# Altium project 06_Dataflow_Modeling.PrjPcb
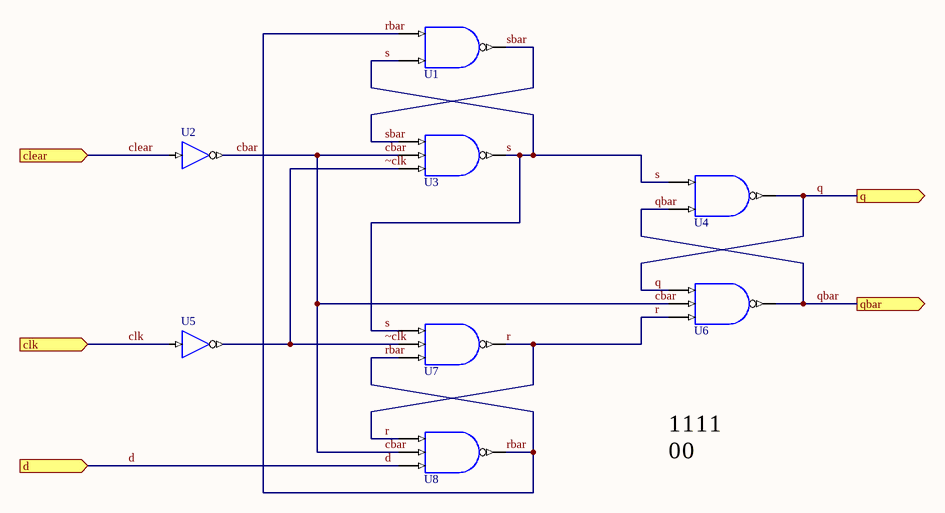
[diagram p0: edge_dff.SchDoc]
6 sheets, 62 parts. Net scope: flat (ports and power ports of the same name join across sheets).
Sheets:
  edge_dff.SchDoc
  edge_dff_drafts.SchDoc
  edge_dff_rst_active.SchDoc
  edge_dff_clk_high.SchDoc
  edge_dff_clk_low.SchDoc
  CarryLookahead.SchDoc

## Sheet edge_dff.SchDoc
size A4

### Parts
U1  AND 2  (value not drawn)
U2  BUF_inv  (value not drawn)
U3  NAND_3  (value not drawn)
U4  AND 2  (value not drawn)
U5  BUF_inv  (value not drawn)
U6  NAND_3  (value not drawn)
U7  NAND_3  (value not drawn)
U8  NAND_3  (value not drawn)

### Ports
clear (in), clk (in), d (in), q (out), qbar (out)

### Nets
cbar: U2.O U3.B U6.B U8.B
clear: U2.I ; port clear
clk: U5.I ; port clk
d: U8.C ; port d
q: U4.Y U6.A ; port q
qbar: U4.B U6.Y ; port qbar
r: U6.C U7.Y U8.A
rbar: U1.A U7.C U8.Y
s: U1.B U3.Y U4.A U7.A
sbar: U1.Y U3.A
~clk: U3.C U5.O U7.B

### Notes on the sheet
- 1
- 0

### Library data of the parts
U1 U4 = AND_2: 2 Input AND
U2 U5 = BUF_inv: 1-bit General Purpose (Non-inverting) Buffer
U3 U6-U8 = NAND_3: 3 Input NAND 1 Not

## Sheet edge_dff_drafts.SchDoc
size A4
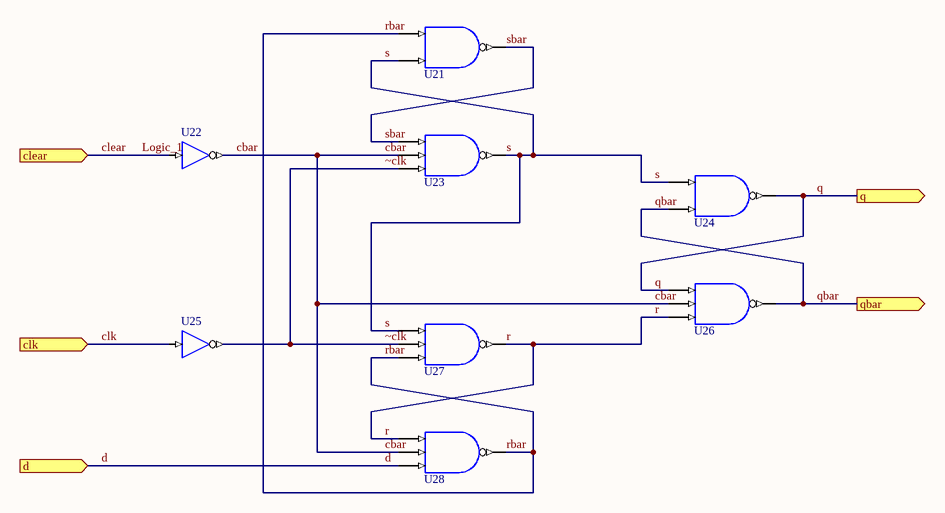
[diagram p1: edge_dff_drafts.SchDoc]

### Parts
U21  AND 2  (value not drawn)
U22  BUF_inv  (value not drawn)
U23  NAND_3  (value not drawn)
U24  AND 2  (value not drawn)
U25  BUF_inv  (value not drawn)
U26  NAND_3  (value not drawn)
U27  NAND_3  (value not drawn)
U28  NAND_3  (value not drawn)

### Ports
clear (in), clk (in), d (in), q (out), qbar (out)

### Nets
cbar: U22.O U23.B U26.B U28.B
clear: U22.I ; port clear  [also labelled Logic_1]
clk: U25.I ; port clk
d: U28.C ; port d
q: U24.Y U26.A ; port q
qbar: U24.B U26.Y ; port qbar
r: U26.C U27.Y U28.A
rbar: U21.A U27.C U28.Y
s: U21.B U23.Y U24.A U27.A
sbar: U21.Y U23.A
~clk: U23.C U25.O U27.B

### Library data of the parts
U21 U24 = AND_2: 2 Input AND
U22 U25 = BUF_inv: as U2 on sheet edge_dff
U23 U26-U28 = NAND_3: 3 Input NAND 1 Not

## Sheet edge_dff_rst_active.SchDoc
size A4
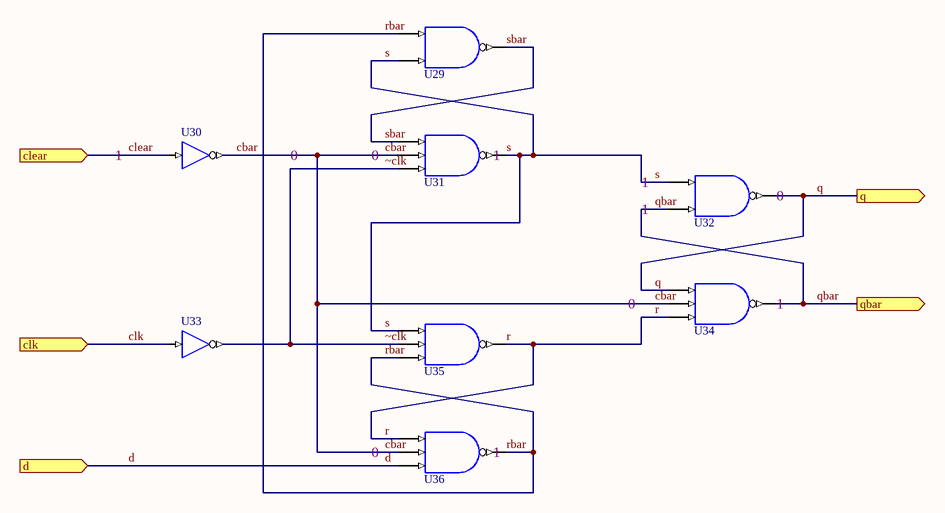
[diagram p2: edge_dff_rst_active.SchDoc]

### Parts
U29  AND 2  (value not drawn)
U30  BUF_inv  (value not drawn)
U31  NAND_3  (value not drawn)
U32  AND 2  (value not drawn)
U33  BUF_inv  (value not drawn)
U34  NAND_3  (value not drawn)
U35  NAND_3  (value not drawn)
U36  NAND_3  (value not drawn)

### Ports
clear (in), clk (in), d (in), q (out), qbar (out)

### Nets
cbar: U30.O U31.B U34.B U36.B
clear: U30.I ; port clear
clk: U33.I ; port clk
d: U36.C ; port d
q: U32.Y U34.A ; port q
qbar: U32.B U34.Y ; port qbar
r: U34.C U35.Y U36.A
rbar: U29.A U35.C U36.Y
s: U29.B U31.Y U32.A U35.A
sbar: U29.Y U31.A
~clk: U31.C U33.O U35.B

### Notes on the sheet
- 1
- 0
- (near U31) 0
- (near U31) 1
- (near U32) 1
- (near U32) 0
- (near U34) 1
- (near U36) 0
- (near U36) 1

### Library data of the parts
U29 U32 = AND_2: 2 Input AND
U30 U33 = BUF_inv: as U2 on sheet edge_dff
U31 U34-U36 = NAND_3: 3 Input NAND 1 Not

## Sheet edge_dff_clk_high.SchDoc
size A4
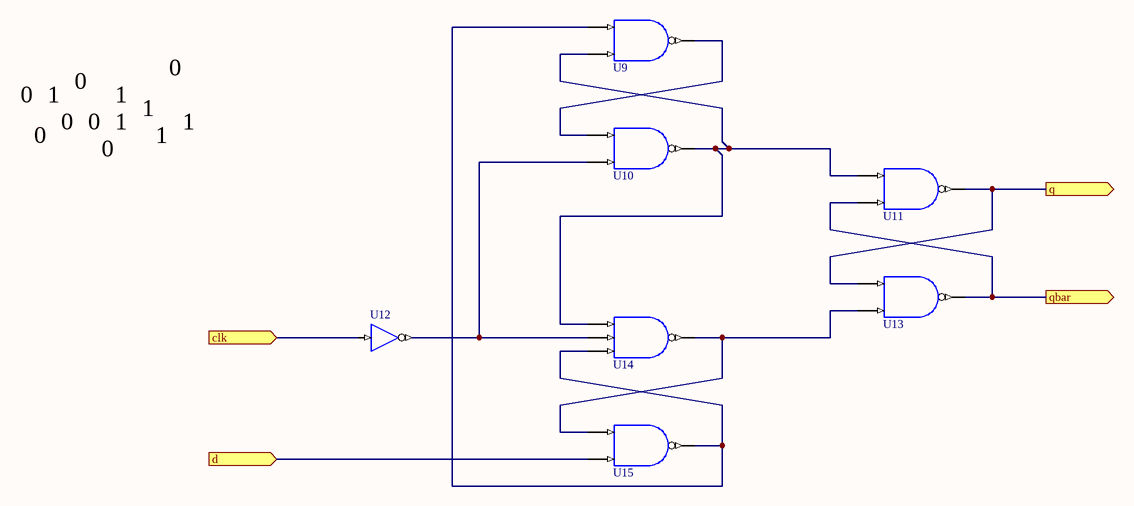
[diagram p3: edge_dff_clk_high.SchDoc]

### Parts
U9  AND 2  (value not drawn)
U10  AND 2  (value not drawn)
U11  AND 2  (value not drawn)
U12  BUF_inv  (value not drawn)
U13  AND 2  (value not drawn)
U14  NAND_3  (value not drawn)
U15  AND 2  (value not drawn)

### Ports
clk (in), d (in), q (out), qbar (out)

### Nets
clk: U12.I ; port clk
d: U15.B ; port d
q: U11.Y U13.A ; port q
qbar: U11.B U13.Y ; port qbar
NetU9_A: U9.A U14.C U15.Y
NetU9_B: U9.B U10.Y U11.A U14.A
NetU9_Y: U9.Y U10.A
NetU10_B: U10.B U12.O U14.B
NetU13_B: U13.B U14.Y U15.A

### Notes on the sheet
- 0
- 1

### Library data of the parts
U9-U11 U13 U15 = AND_2: 2 Input AND
U12 = BUF_inv: as U2 on sheet edge_dff
U14 = NAND_3: 3 Input NAND 1 Not

## Sheet edge_dff_clk_low.SchDoc
size A4
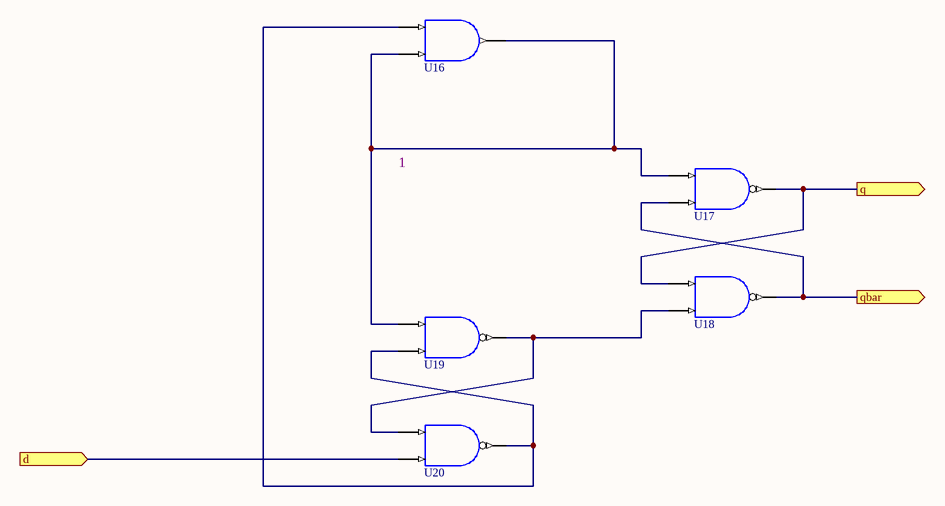
[diagram p4: edge_dff_clk_low.SchDoc]

### Parts
U16  AND 2  (value not drawn)
U17  AND 2  (value not drawn)
U18  AND 2  (value not drawn)
U19  AND 2  (value not drawn)
U20  AND 2  (value not drawn)

### Ports
d (in), q (out), qbar (out)

### Nets
d: U20.B ; port d
q: U17.Y U18.A ; port q
qbar: U17.B U18.Y ; port qbar
NetU16_A: U16.A U19.B U20.Y
NetU16_B: U16.B U16.Y U17.A U19.A
NetU18_B: U18.B U19.Y U20.A

### Notes on the sheet
- 1

### Library data of the parts
U16-U20 = AND_2: 2 Input AND

## Sheet CarryLookahead.SchDoc
size A4
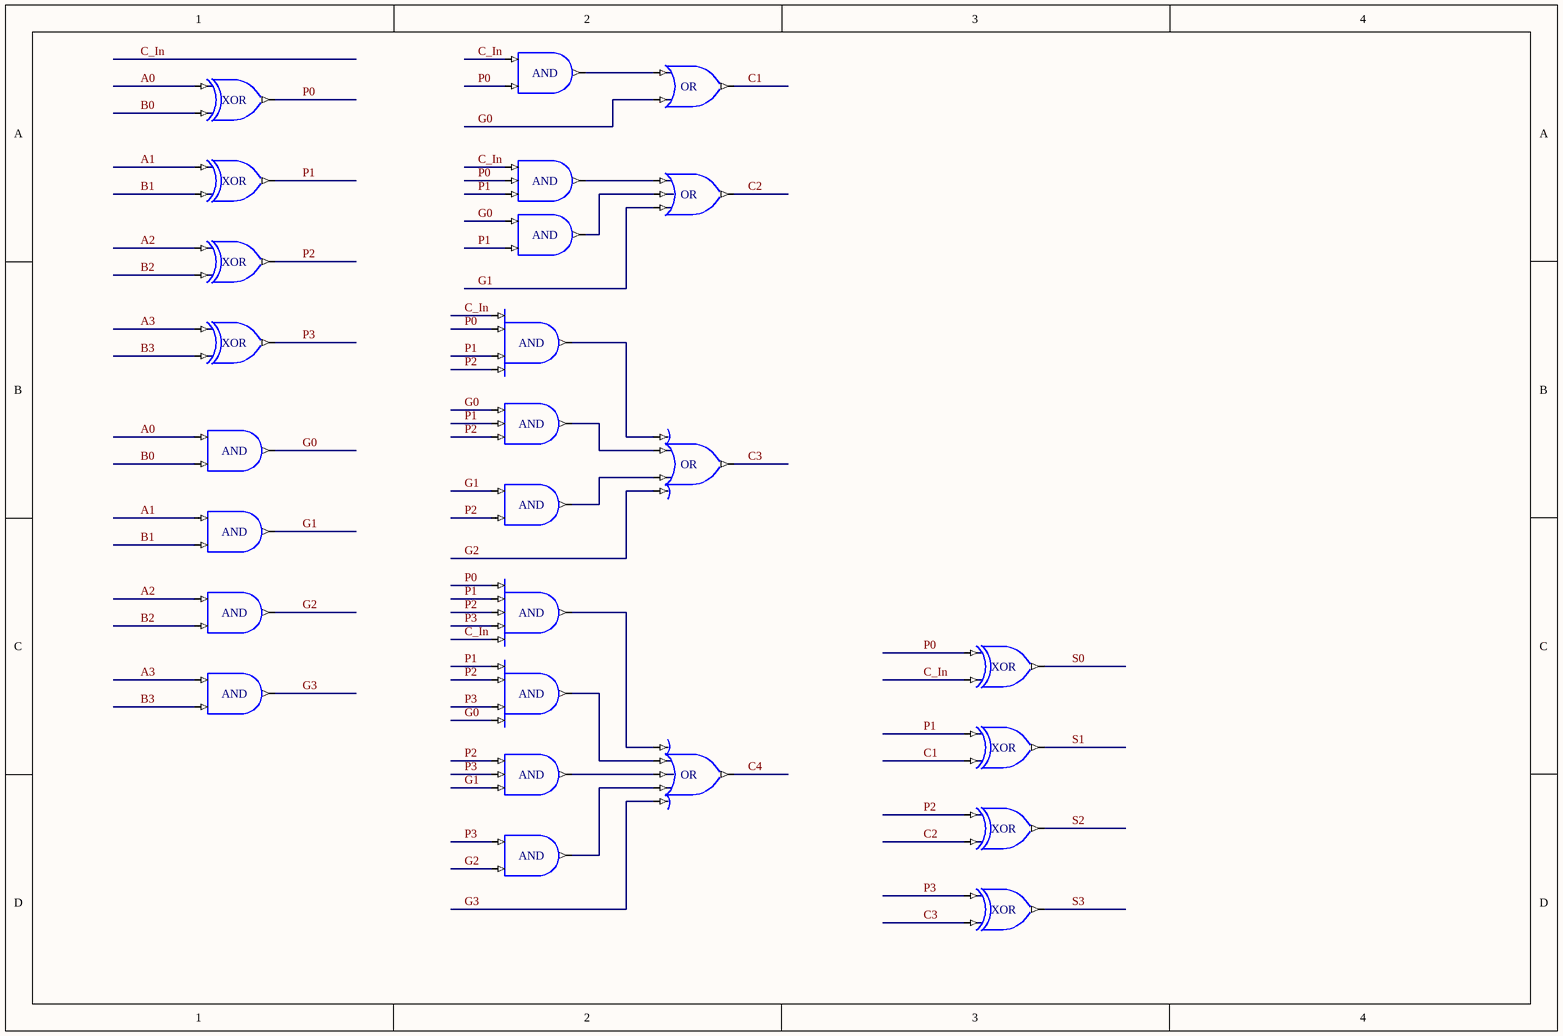
[diagram p5: CarryLookahead.SchDoc]

### Parts
(Parts that share a designator on the sheet are numbered #1, #2 ... from top to bottom, then left to right.)
U?#1  AND
U?#2  OR
U?#3  XOR
U?#4  XOR
U?#5  AND
U?#6  OR
U?#7  AND
U?#8  XOR
U?#9  XOR
U?#10  AND
U?#11  AND
U?#12  AND
U?#13  OR
U?#14  AND
U?#15  AND
U?#16  AND
U?#17  AND
U?#18  XOR
U?#19  AND
U?#20  AND
U?#21  XOR
U?#22  AND
U?#23  OR
U?#24  XOR
U?#25  AND
U?#26  XOR

### Nets
A0: U?#3.I0 U?#12.I0
A1: U?#4.I0 U?#15.I0
A2: U?#8.I0 U?#16.I0
A3: U?#9.I0 U?#19.I0
B0: U?#3.I1 U?#12.I1
B1: U?#4.I1 U?#15.I1
B2: U?#8.I1 U?#16.I1
B3: U?#9.I1 U?#19.I1
C1: U?#2.O U?#21.I1
C2: U?#6.O U?#24.I1
C3: U?#13.O U?#26.I1
C4: U?#23.O
C_In: U?#1.I0 U?#5.I0 U?#10.I0 U?#17.I4 U?#18.I1
G0: U?#2.I1 U?#7.I0 U?#11.I0 U?#12.O U?#20.I3
G1: U?#6.I2 U?#14.I0 U?#15.O U?#22.I2
G2: U?#13.I3 U?#16.O U?#25.I1
G3: U?#19.O U?#23.I4
P0: U?#1.I1 U?#3.O U?#5.I1 U?#10.I1 U?#17.I0 U?#18.I0
P1: U?#4.O U?#5.I2 U?#7.I1 U?#10.I2 U?#11.I1 U?#17.I1 U?#20.I0 U?#21.I0
P2: U?#8.O U?#10.I3 U?#11.I2 U?#14.I1 U?#17.I2 U?#20.I1 U?#22.I0 U?#24.I0
P3: U?#9.O U?#17.I3 U?#20.I2 U?#22.I1 U?#25.I0 U?#26.I0
S0: U?#18.O
S1: U?#21.O
S2: U?#24.O
S3: U?#26.O
NetU?#1_O: U?#1.O U?#2.I0
NetU?#5_O: U?#5.O U?#6.I0
NetU?#6_I1: U?#6.I1 U?#7.O
NetU?#10_O: U?#10.O U?#13.I0
NetU?#11_O: U?#11.O U?#13.I1
NetU?#13_I2: U?#13.I2 U?#14.O
NetU?#17_O: U?#17.O U?#23.I0
NetU?#20_O: U?#20.O U?#23.I1
NetU?#22_O: U?#22.O U?#23.I2
NetU?#23_I3: U?#23.I3 U?#25.O

### Library data of the parts
U?#1 U?#7 U?#12 U?#14-U?#16 U?#19 U?#25 = AND2S: 2-Input AND Gate, Single Pin Version; XilinxEquivalent: AND2; FunctionalClass: Logic Primitive; PortSize: 2; ArchiveName: GENERIC; VHDLIB_SIM: GENERIC_LIB; Published: 29-Jan-2004; Publisher: Altium Limited; LastRevisionNo: 1.00.00; HelpURL: CR0118 FPGA Generic Library Guide.pdf#page=114; ComponentLink1URL: CR0136 FPGA Logic Primitive Resource Usage.pdf#page=13; ComponentLink1Description: Core &Resource Usage; SubClass: AND; PortStyle: Single Pin Version
U?#2 = OR2S: 2-Input OR Gate, Single Pin Version; XilinxEquivalent: OR2; FunctionalClass: Logic Primitive; PortSize: 2; ArchiveName: GENERIC; VHDLIB_SIM: GENERIC_LIB; Published: 29-Jan-2004; Publisher: Altium Limited; LastRevisionNo: 1.00.00; HelpURL: CR0118 FPGA Generic Library Guide.pdf#page=410; ComponentLink1URL: CR0136 FPGA Logic Primitive Resource Usage.pdf#page=190; ComponentLink1Description: Core &Resource Usage; SubClass: OR; PortStyle: Single Pin Version
U?#3 U?#4 U?#8 U?#9 U?#18 U?#21 U?#24 U?#26 = XOR2S: 2-Input Exclusive-OR Gate, Single Pin Version; XilinxEquivalent: XOR2; FunctionalClass: Logic Primitive; PortSize: 2; ArchiveName: GENERIC; VHDLIB_SIM: GENERIC_LIB; Published: 29-Jan-2004; Publisher: Altium Limited; LastRevisionNo: 1.00.00; HelpURL: CR0118 FPGA Generic Library Guide.pdf#page=448; ComponentLink1URL: CR0136 FPGA Logic Primitive Resource Usage.pdf#page=301; ComponentLink1Description: Core &Resource Usage; SubClass: XOR; PortStyle: Single Pin Version
U?#5 U?#11 U?#22 = AND3S: 3-Input AND Gate, Single Pin Version; XilinxEquivalent: AND3; FunctionalClass: Logic Primitive; PortSize: 3; ArchiveName: GENERIC; VHDLIB_SIM: GENERIC_LIB; Published: 29-Jan-2004; Publisher: Altium Limited; LastRevisionNo: 1.00.00; HelpURL: CR0118 FPGA Generic Library Guide.pdf#page=114; ComponentLink1URL: CR0136 FPGA Logic Primitive Resource Usage.pdf#page=23; ComponentLink1Description: Core &Resource Usage; SubClass: AND; PortStyle: Single Pin Version
U?#6 = OR3S: 3-Input OR Gate, Single Pin Version; XilinxEquivalent: OR3; FunctionalClass: Logic Primitive; PortSize: 3; ArchiveName: GENERIC; VHDLIB_SIM: GENERIC_LIB; Published: 29-Jan-2004; Publisher: Altium Limited; LastRevisionNo: 1.00.00; HelpURL: CR0118 FPGA Generic Library Guide.pdf#page=410; ComponentLink1URL: CR0136 FPGA Logic Primitive Resource Usage.pdf#page=200; ComponentLink1Description: Core &Resource Usage; SubClass: OR; PortStyle: Single Pin Version
U?#10 U?#20 = AND4S: 4-Input AND Gate, Single Pin Version; XilinxEquivalent: AND4; FunctionalClass: Logic Primitive; PortSize: 4; ArchiveName: GENERIC; VHDLIB_SIM: GENERIC_LIB; Published: 29-Jan-2004; Publisher: Altium Limited; LastRevisionNo: 1.00.00; HelpURL: CR0118 FPGA Generic Library Guide.pdf#page=114; ComponentLink1URL: CR0136 FPGA Logic Primitive Resource Usage.pdf#page=35; ComponentLink1Description: Core &Resource Usage; SubClass: AND; PortStyle: Single Pin Version
U?#13 = OR4S: 4-Input OR Gate, Single Pin Version; XilinxEquivalent: OR4; FunctionalClass: Logic Primitive; PortSize: 4; ArchiveName: GENERIC; VHDLIB_SIM: GENERIC_LIB; Published: 29-Jan-2004; Publisher: Altium Limited; LastRevisionNo: 1.00.00; HelpURL: CR0118 FPGA Generic Library Guide.pdf#page=410; ComponentLink1URL: CR0136 FPGA Logic Primitive Resource Usage.pdf#page=212; ComponentLink1Description: Core &Resource Usage; SubClass: OR; PortStyle: Single Pin Version
U?#17 = AND5S: 5-Input AND Gate, Single Pin Version; XilinxEquivalent: AND5; FunctionalClass: Logic Primitive; PortSize: 5; ArchiveName: GENERIC; VHDLIB_SIM: GENERIC_LIB; Published: 29-Jan-2004; Publisher: Altium Limited; LastRevisionNo: 1.00.00; HelpURL: CR0118 FPGA Generic Library Guide.pdf#page=114; ComponentLink1URL: CR0136 FPGA Logic Primitive Resource Usage.pdf#page=47; ComponentLink1Description: Core &Resource Usage; SubClass: AND; PortStyle: Single Pin Version
U?#23 = OR5S: 5-Input OR Gate, Single Pin Version; XilinxEquivalent: OR5; FunctionalClass: Logic Primitive; PortSize: 5; ArchiveName: GENERIC; VHDLIB_SIM: GENERIC_LIB; Published: 29-Jan-2004; Publisher: Altium Limited; LastRevisionNo: 1.00.00; HelpURL: CR0118 FPGA Generic Library Guide.pdf#page=410; ComponentLink1URL: CR0136 FPGA Logic Primitive Resource Usage.pdf#page=224; ComponentLink1Description: Core &Resource Usage; SubClass: OR; PortStyle: Single Pin Version

## Nets that join several sheets
clear: edge_dff (U2.I), edge_dff_drafts (U22.I), edge_dff_rst_active (U30.I)
clk: edge_dff (U5.I), edge_dff_drafts (U25.I), edge_dff_rst_active (U33.I), edge_dff_clk_high (U12.I)
d: edge_dff (U8.C), edge_dff_drafts (U28.C), edge_dff_rst_active (U36.C), edge_dff_clk_high (U15.B), edge_dff_clk_low (U20.B)
q: edge_dff (U4.Y U6.A), edge_dff_drafts (U24.Y U26.A), edge_dff_rst_active (U32.Y U34.A), edge_dff_clk_high (U11.Y U13.A), edge_dff_clk_low (U17.Y U18.A)
qbar: edge_dff (U4.B U6.Y), edge_dff_drafts (U24.B U26.Y), edge_dff_rst_active (U32.B U34.Y), edge_dff_clk_high (U11.B U13.Y), edge_dff_clk_low (U17.B U18.Y)